# Altium project PID_preheaterV2.PrjPcb
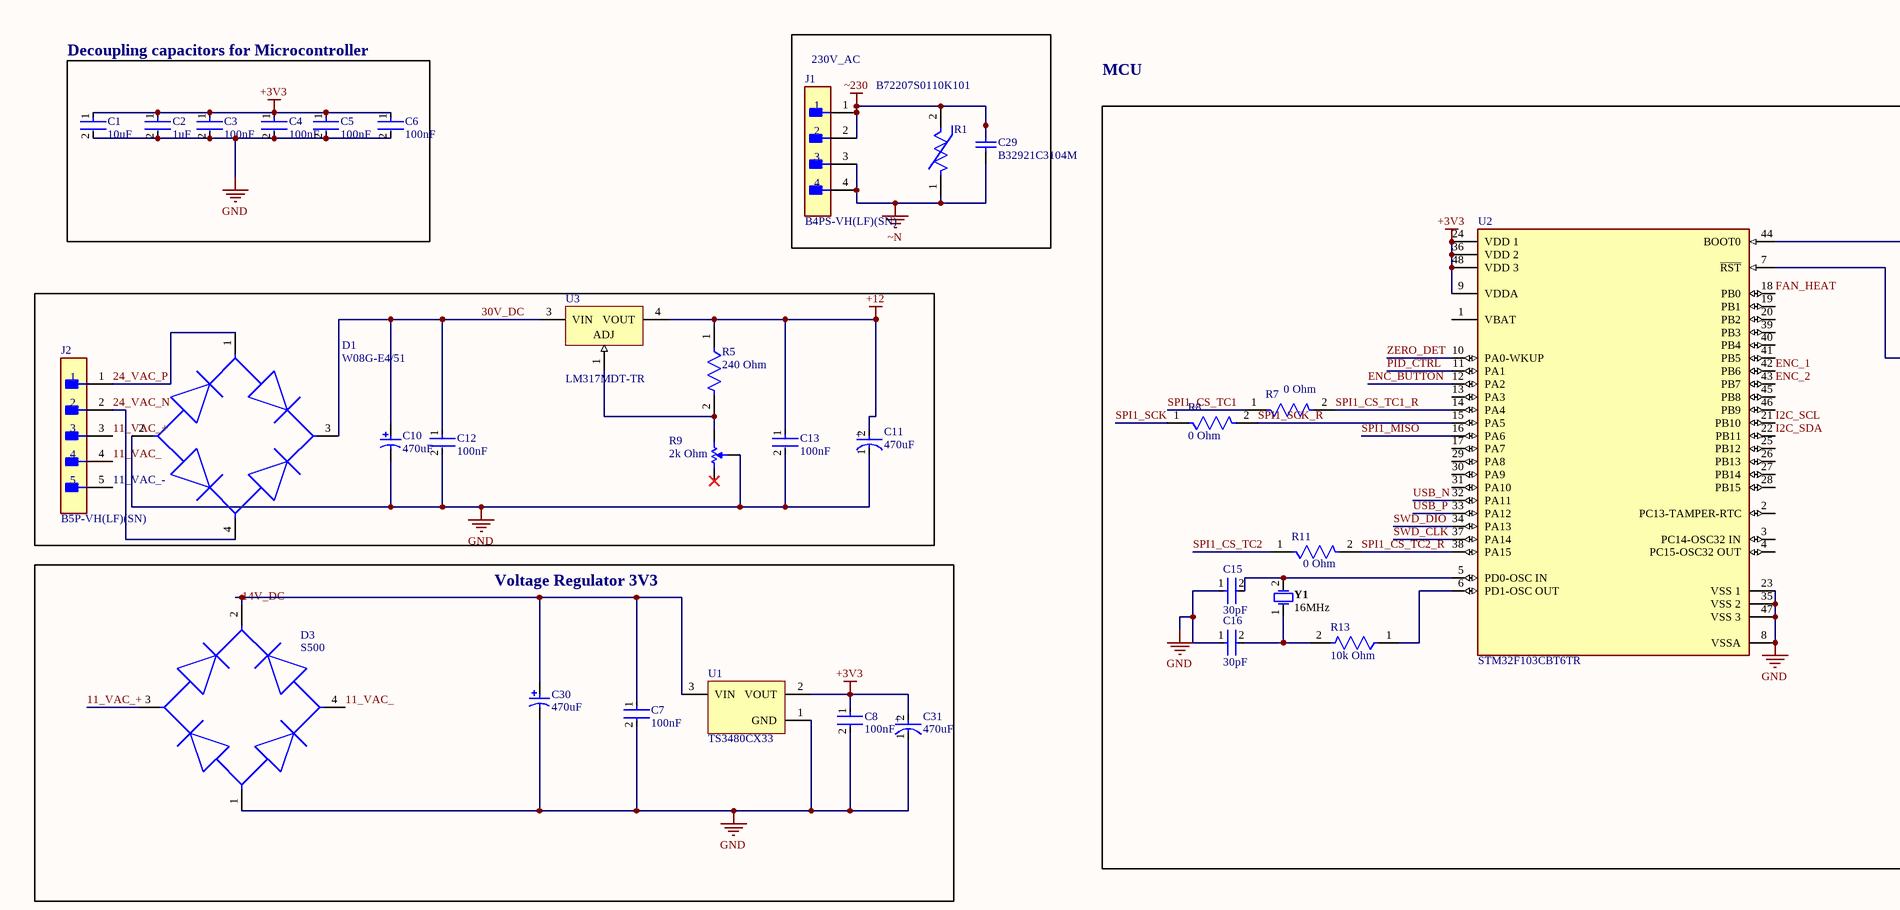
[diagram p0: SheetV2.SchDoc, top left]
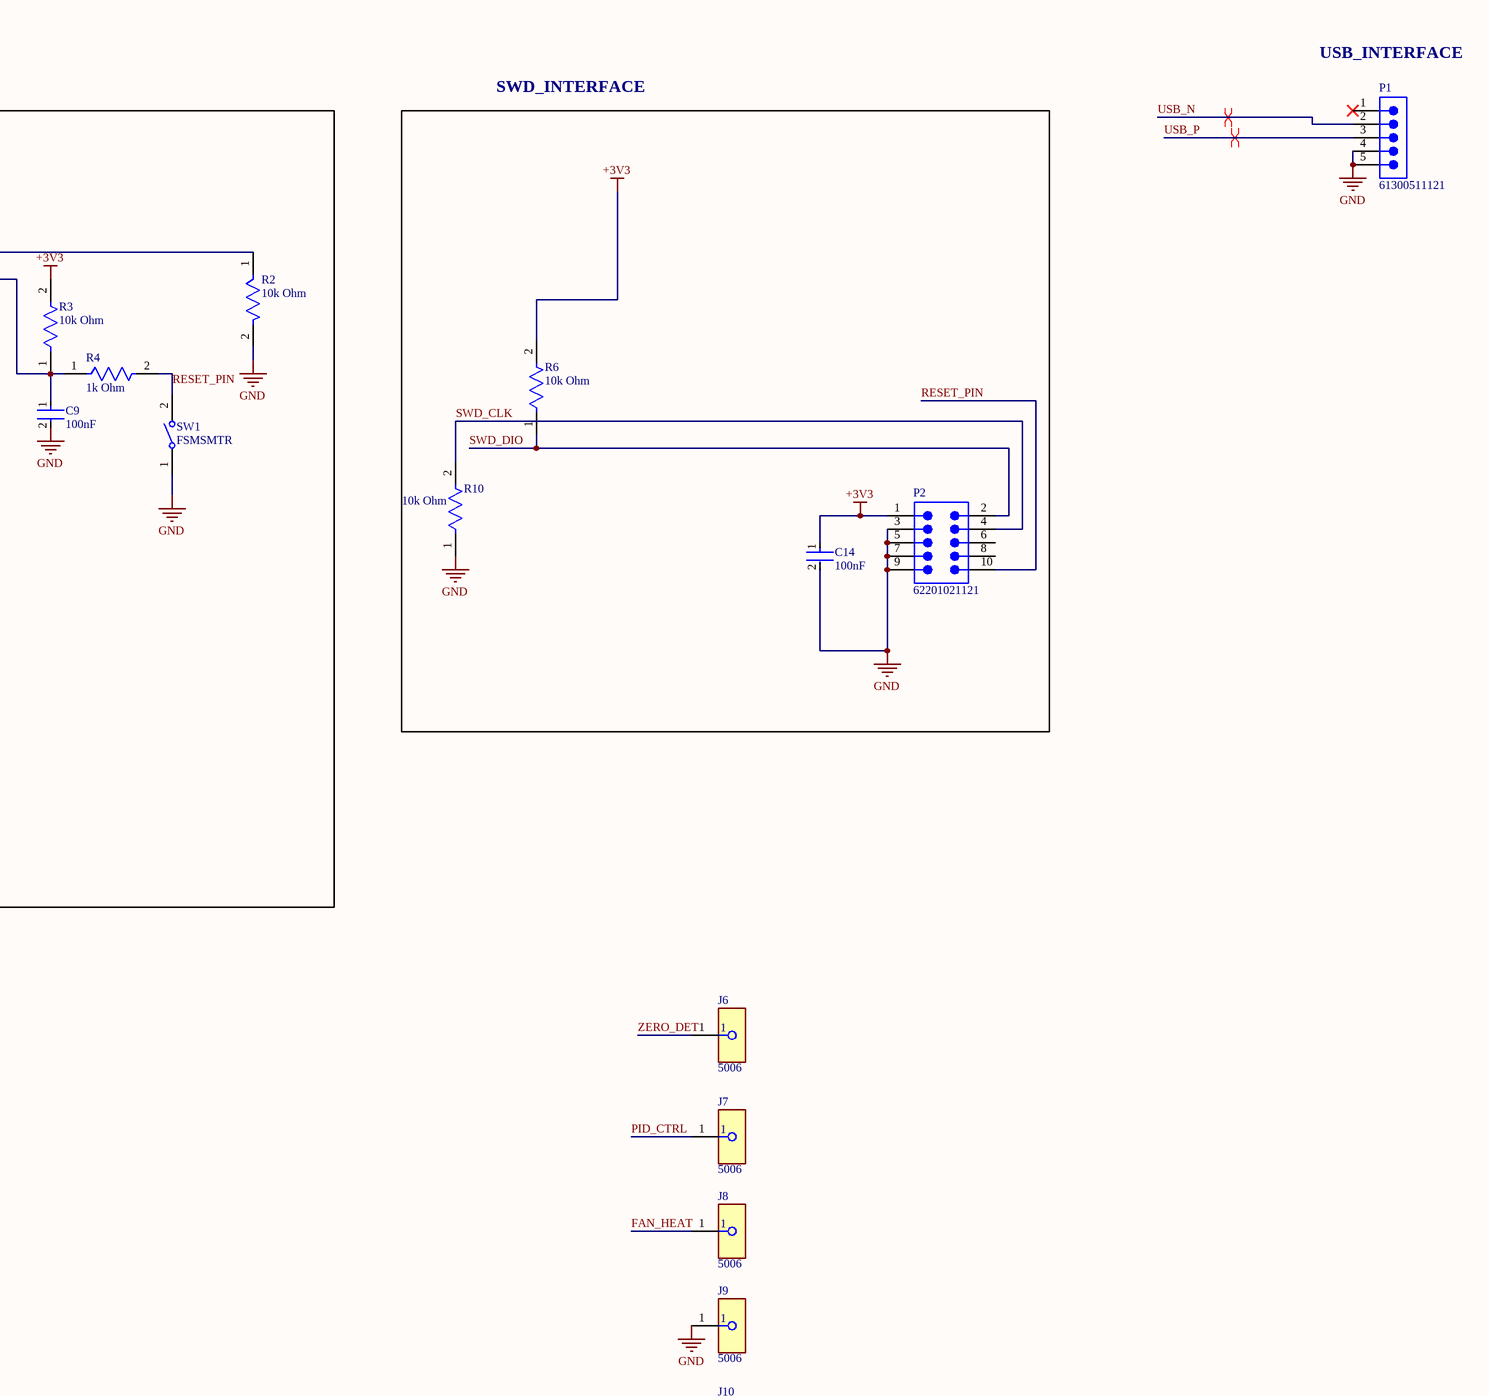
[diagram p1: SheetV2.SchDoc, top right]
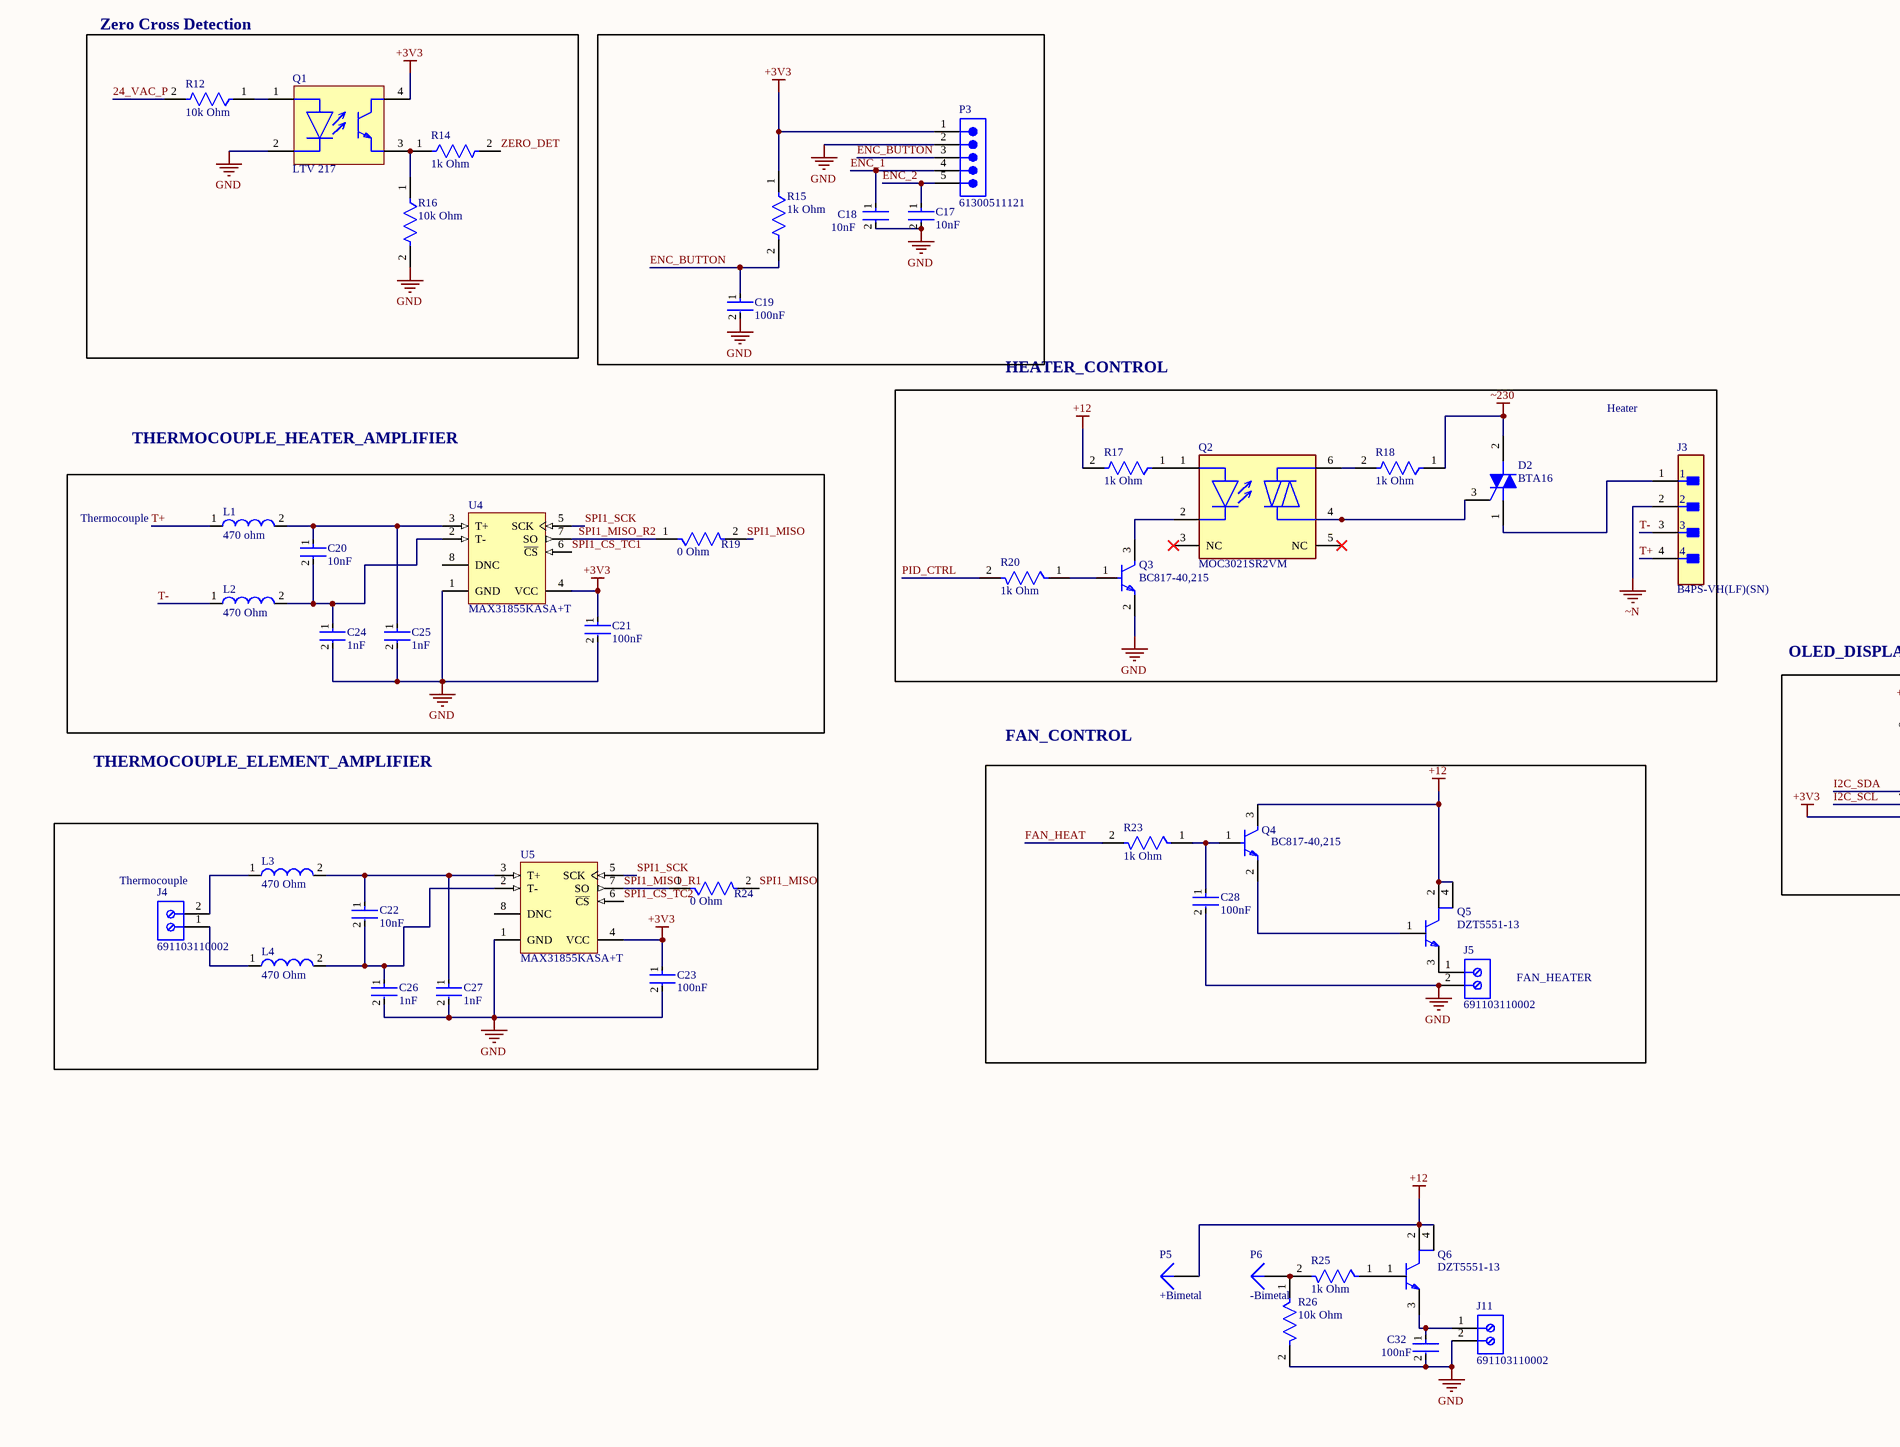
[diagram p2: SheetV2.SchDoc, bottom left]
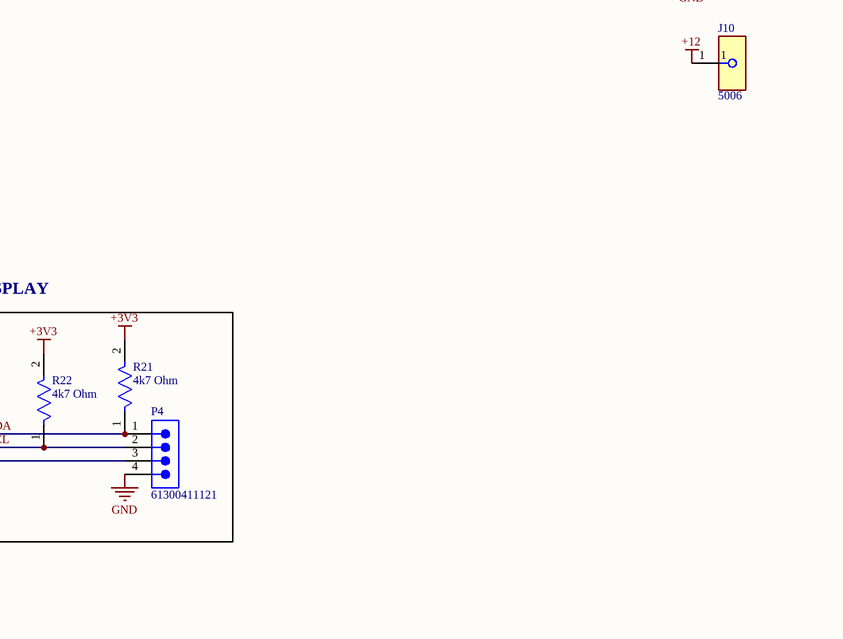
[diagram p3: SheetV2.SchDoc, bottom right]
1 sheet, 95 parts. Net scope: global (net labels, ports and power ports of the same name join across sheets).
Board file: PCBV21.PcbDoc

## Sheet SheetV2.SchDoc: PID Heater upgrade
size A1; Date: 06.07.2025; Author: Grzegorz Jabłoński; DrawnBy: Grzegorz Jabłoński; DocumentNumber: 1/1; Revision: V2.0; SheetNumber: 1; SheetTotal: 1

### Parts
C1  10uF  [FP-CC0805-0_85-MFG]
C2  1uF  [FP-CC0805-0_85-MFG]
C3  100nF  [FP-CC0805-0_85-MFG]
C4  100nF  [FP-CC0805-0_85-MFG]
C5  100nF  [FP-CC0805-0_85-MFG]
C6  100nF  [FP-CC0805-0_85-MFG]
C7  100nF  [FP-CC0805-0_85-MFG]
C8  100nF  [FP-CC0805-0_85-MFG]
C9  100nF  [FP-CC0805-0_85-MFG]
C10  470uF  [CAPPR65-500-2000X1000X2200]
C11  470uF  [FP-RAD-TH-D_8_0_5-L_11_5-MFG]
C12  100nF  [FP-CC0805-0_85-MFG]
C13  100nF  [FP-CC0805-0_85-MFG]
C14  100nF  [FP-CC0805-0_85-MFG]
C15  30pF  [FP-CC0805-0_85-MFG]
C16  30pF  [FP-CC0805-0_85-MFG]
C17  10nF  [FP-CC0805-0_85-MFG]
C18  10nF  [FP-CC0805-0_85-MFG]
C19  100nF  [FP-CC0805-0_85-MFG]
C20  10nF  [FP-CC0805-0_85-MFG]
C21  100nF  [FP-CC0805-0_85-MFG]
C22  10nF  [FP-CC0805-0_85-MFG]
C23  100nF  [FP-CC0805-0_85-MFG]
C24  1nF  [FP-CC0805-0_85-MFG]
C25  1nF  [FP-CC0805-0_85-MFG]
C26  1nF  [FP-CC0805-0_85-MFG]
C27  1nF  [FP-CC0805-0_85-MFG]
C28  100nF  [FP-CC0805-0_85-MFG]
C29  B32921C3104M  [TDK-B32921C3104M]
C30  470uF  [CAPPR65-500-2000X1000X2200]
C31  470uF  [FP-RAD-TH-D_8_0_5-L_11_5-MFG]
C32  100nF  [FP-CC0805-0_85-MFG]
D1  W08G-E4/51  [FP-WOG-MFG]
D2  BTA16  [ONSC-TO-220-3-221A-09]
D3  S500  [FP-MB2S-E3-80-MFG]
J1  B4PS-VH(LF)(SN)  [FP-B4PS-VH_LF_SN-MFG]
J2  B5P-VH(LF)(SN)  [FP-B5P-VH_LF_SN-MFG]
J3  B4PS-VH(LF)(SN)  [FP-B4PS-VH_LF_SN-MFG]
J4  691103110002  [691103110002]
J5  691103110002  [691103110002]
J6  5006  [FP-5006-MFG]
J7  5006  [FP-5006-MFG]
J8  5006  [FP-5006-MFG]
J9  5006  [FP-5006-MFG]
J10  5006  [FP-5006-MFG]
J11  691103110002  [691103110002]
L1  470 ohm  [SMD-0805]
L2  470 Ohm  [SMD-0805]
L3  470 Ohm  [SMD-0805]
L4  470 Ohm  [SMD-0805]
P1  61300511121  [61300511121]
P2  62201021121  [62201021121]
P3  61300511121  [61300511121]
P4  61300411121  [61300411121]
P5  +Bimetal  [PIN1]
P6  -Bimetal  [PIN1]
Q1  LTV 217  [SOP127P700X210_HS-5_SO4-Opto2_N]
Q2  MOC3021SR2VM  [FP-646BY-MFG]
Q3  BC817-40,215  [FP-SOT23-MFG]
Q4  BC817-40,215  [FP-SOT23-MFG]
Q5  DZT5551-13  [FP-SOT223-MFG]
Q6  DZT5551-13  [FP-SOT223-MFG]
R1  B72207S0110K101  [FP-B72207S0110K101-MFG]
R2  10k Ohm  [FP-RMCF0805-MFG]
R3  10k Ohm  [FP-RMCF0805-MFG]
R4  1k Ohm  [FP-RMCF0805-MFG]
R5  240 Ohm  [FP-RMCF0805-MFG]
R6  10k Ohm  [FP-RMCF0805-MFG]
R7  0 Ohm  [FP-RMCF0805-MFG]
R8  0 Ohm  [FP-RMCF0805-MFG]
R9  2k Ohm  [BOUR-3296W-1-3]
R10  10k Ohm  [FP-RMCF0805-MFG]
R11  0 Ohm  [FP-RMCF0805-MFG]
R12  10k Ohm  [FP-RMCF0805-MFG]
R13  10k Ohm  [FP-RMCF0805-MFG]
R14  1k Ohm  [FP-RMCF0805-MFG]
R15  1k Ohm  [FP-RMCF0805-MFG]
R16  10k Ohm  [FP-RMCF0805-MFG]
R17  1k Ohm  [FP-RMCF0805-MFG]
R18  1k Ohm  [FP-RMCF0805-MFG]
R19  0 Ohm  [FP-RMCF0805-MFG]
R20  1k Ohm  [FP-RMCF0805-MFG]
R21  4k7 Ohm  [FP-RMCF0805-MFG]
R22  4k7 Ohm  [FP-RMCF0805-MFG]
R23  1k Ohm  [FP-RMCF0805-MFG]
R24  0 Ohm  [FP-RMCF0805-MFG]
R25  1k Ohm  [FP-RMCF0805-MFG]
R26  10k Ohm  [FP-RMCF0805-MFG]
SW1  FSMSMTR  [TECO-FSMSMTR_V]
U1  TS3480CX33  [SOT-23-TT3_L]
U2  STM32F103CBT6TR  [FP-LQFP48-5B-MFG]
U3  LM317MDT-TR  [TO-252_L]
U4  MAX31855KASA+T  [MAXM-S8+4_N]
U5  MAX31855KASA+T  [MAXM-S8+4_N]
Y1  16MHz  [FOX-FOXSLF160-20]

### Blocks framed on the sheet
Decoupling capacitors for Microcontroller: C1-C6
230V_AC: C29 J1 R1
SWD_INTERFACE: C14 P2 R6 R10
11_VAC_-: C10-C13 D1 J2 R5 R9 U3
Voltage Regulator 3V3: C7 C8 C30 C31 D3 U1
Zero Cross Detection: Q1 R12 R14 R16
HEATER_CONTROL: D2 J3 Q2 Q3 R17 R18 R20
Thermocouple: C20 C21 C24 C25 L1 L2 R19 U4
OLED_DISPLAY: P4 R21 R22
FAN_HEATER: C28 J5 Q4 Q5 R23
Thermocouple: C22 C23 C26 C27 J4 L3 L4 R24 U5

### Nets
+3V3: C1.1 C2.1 C3.1 C4.1 C5.1 C6.1 C8.1 C14.1 C21.1 C23.1 C31.2(A) P2.1 P3.1 P4.3 Q1.4(C) R3.2 R6.2 R15.1 R21.2 R22.2 U1.2(VOUT) U2.9(VDDA) U2.24(VDD_1) U2.36(VDD_2) U2.48(VDD_3) U4.4(VCC) U5.4(VCC)
+12: C11.2(A) C13.1 J10.1 P5.1 Q4.3(C) Q5.2(C) Q5.4(C) Q6.2(C) Q6.4(C) R5.1 R17.2 U3.4(VOUT)
GND: C1.2 C2.2 C3.2 C4.2 C5.2 C6.2 C7.2 C8.2 C9.2 C10.2 C11.1(C) C12.2 C13.2 C14.2 C15.1 C16.1 C17.2 C18.2 C19.2 C21.2 C23.2 C24.2 C25.2 C26.2 C27.2 C28.2 C30.2 C31.1(C) C32.2 D1.2(+) D3.1(C) J5.2 J9.1 J11.2 P1.4 P1.5 P2.3 P2.5 P2.7 P2.9 P3.2 P4.4 Q1.2(C) Q3.2(E) R2.2 R9.3(TAP) R10.1 R16.2 R26.2 SW1.1 U1.1(GND) U2.8(VSSA) U2.23(VSS_1) U2.35(VSS_2) U2.47(VSS_3) U4.1(GND) U5.1(GND)
~230: C29.2 D2.2(MT2) J1.1 J1.2 R1.2 R18.1
~N: C29.1 J1.3 J1.4 J3.2 R1.1
11_VAC_: D3.4(2_~) J2.4
11_VAC_+: D3.3(1_~) J2.3
14V_DC: C7.1 C30.1 D3.2(A) U1.3(VIN)
24_VAC_N: D1.4(2_~) J2.2
24_VAC_P: D1.1(1_~) J2.1 R12.2
30V_DC: C10.1 C12.1 D1.3(-) U3.3(VIN)
ENC_1: C18.1 P3.4 U2.42(PB6)
ENC_2: C17.1 P3.5 U2.43(PB7)
ENC_BUTTON: C19.1 P3.3 R15.2 U2.12(PA2)
FAN_HEAT: J8.1 R23.2 U2.18(PB0)
I2C_SCL: P4.2 R22.1 U2.21(PB10)
I2C_SDA: P4.1 R21.1 U2.22(PB11)
PID_CTRL: J7.1 R20.2 U2.11(PA1)
RESET_PIN: P2.10 R4.2 SW1.2
SPI1_CS_TC1: R7.1 U4.6(~{CS})
SPI1_CS_TC1_R: R7.2 U2.14(PA4)
SPI1_CS_TC2: R11.1 U5.6(~{CS})
SPI1_CS_TC2_R: R11.2 U2.38(PA15)
SPI1_MISO: R19.2 R24.2 U2.16(PA6)
SPI1_MISO_R1: R24.1 U5.7(SO)
SPI1_MISO_R2: R19.1 U4.7(SO)
SPI1_SCK: R8.1 U4.5(SCK) U5.5(SCK)
SPI1_SCK_R: R8.2 U2.15(PA5)
SWD_CLK: P2.4 R10.2 U2.37(PA14)
SWD_DIO: P2.2 R6.1 U2.34(PA13)
T+: J3.4 L1.1
T-: J3.3 L2.1
USB_N: P1.2 U2.32(PA11)
USB_P: P1.3 U2.33(PA12)
ZERO_DET: J6.1 R14.2 U2.10(PA0-WKUP)
NetC9_1: C9.1 R3.1 R4.1 U2.7(~{RST})
NetC15_2: C15.2 U2.5(PD0-OSC_IN) Y1.2
NetC16_2: C16.2 R13.2 Y1.1
NetC20_1: C20.1 C25.1 L1.2 U4.3(T+)
NetC20_2: C20.2 C24.1 L2.2 U4.2(T-)
NetC22_1: C22.1 C27.1 L3.2 U5.3(T+)
NetC22_2: C22.2 C26.1 L4.2 U5.2(T-)
NetC28_1: C28.1 Q4.1(B) R23.1
NetC32_1: C32.1 J11.1 Q6.3(E)
NetD2_1: D2.1(MT1) J3.1
NetD2_3: D2.3(G) Q2.4(1_MAIN_TERM)
NetJ4_1: J4.1 L4.1
NetJ4_2: J4.2 L3.1
NetJ5_1: J5.1 Q5.3(E)
NetP6_1: P6.1 R25.2 R26.1
NetQ1_1: Q1.1(A) R12.1
NetQ1_3: Q1.3(E) R14.1 R16.1
NetQ2_1: Q2.1(A) R17.1
NetQ2_2: Q2.2(C) Q3.3(C)
NetQ2_6: Q2.6(2_MAIN_TERM) R18.2
NetQ3_1: Q3.1(B) R20.1
NetQ4_2: Q4.2(E) Q5.1(B)
NetQ6_1: Q6.1(B) R25.1
NetR2_1: R2.1 U2.44(BOOT0)
NetR5_2: R5.2 R9.2(B) U3.1(ADJ)
NetR13_1: R13.1 U2.6(PD1-OSC_OUT)

Not connected (* = marked no-connect by the designer): J2 5; P1 1*; P2 6 8; Q2 3(NC)* 5(NC)*; R9 1(A)*; U2 1(VBAT) 2(PC13-TAMPER-RTC) 3(PC14-OSC32_IN) 4(PC15-OSC32_OUT) 13(PA3) 17(PA7) 19(PB1) 20(PB2) 25(PB12) 26(PB13) 27(PB14) 28(PB15) 29(PA8) 30(PA9) 31(PA10) 39(PB3) 40(PB4) 41(PB5) 45(PB8) 46(PB9); U4 8(DNC); U5 8(DNC)

### Layout directives
differential pair: USB_N, USB_P

### Notes on the sheet
- MCU
- (near P1) USB_INTERFACE
- THERMOCOUPLE_HEATER_AMPLIFIER
- Heater
- THERMOCOUPLE_ELEMENT_AMPLIFIER
- FAN_CONTROL
- (in symbol CMP-05427-001287-1) +

### Library data of the parts
C1 C2 C15-C18 C20 C22 C24-C27 = CMP-2100-03606-3: CAP CER 0.1UF 50V X7R 0805; Manufacturer Part Number: CC0805KRX7R9BB104; Manufacturer: Yageo; Tolerance: 0.1; Capacitance: 100 nF; Value: 100 nF; Material: Ceramic; Device Class L1: Passive Components; ComponentLink2Description: Datasheet; Package: CC0805-0.85; Digikey Description: CAP CER 0.1UF 50V X7R 0805; Device Class L3: Ceramic Capacitors; Temperature: -30°C to +85°C; Temperature Characteristic: X7R; Voltage Rating: 50 V; Height: 0.95mm; RoHS: TRUE; Ipc Land Pattern Name: CAPC200125X85; Device Class L2: Capacitors; Category: Cap; Temperature Range Low: -30°C; Temperature Range High: +85°C; Mouser Description: Multilayer Ceramic Capacitors MLCC - SMD/SMT 100nF 50V X7R 10%; Footprint Url: http://www.yageo.com/exep/pages/download/literatures/UPY-C_GEN_24.pdf; Automotive: No; Octopart: https://octopart.com/cc0805krx7r9bb104-yageo-192993; Lead Free: Yes; ComponentLink2URL: http://www.yageo.com/documents/recent/UPY-GPHC_Y5V_6.3V-to-50V_8.pdf
C3-C9 C12-C14 C19 C21 C23 C28 C32 = CMP-2100-03606-3: CAP CER 0.1UF 50V X7R 0805; Manufacturer Part Number: CC0805KRX7R9BB104; Manufacturer: Yageo; Tolerance: 0.1; Material: Ceramic; Device Class L1: Passive Components; ComponentLink2Description: Datasheet; Package: CC0805-0.85; Digikey Description: CAP CER 0.1UF 50V X7R 0805; Capacitance: 100 nF; Device Class L3: Ceramic Capacitors; Value: 100 nF; Temperature: -30°C to +85°C; Temperature Characteristic: X7R; Voltage Rating: 50 V; Height: 0.95mm; RoHS: TRUE; Ipc Land Pattern Name: CAPC200125X85; Device Class L2: Capacitors; Category: Cap; Temperature Range Low: -30°C; Temperature Range High: +85°C; Mouser Description: Multilayer Ceramic Capacitors MLCC - SMD/SMT 100nF 50V X7R 10%; Footprint Url: http://www.yageo.com/exep/pages/download/literatures/UPY-C_GEN_24.pdf; Automotive: No; Octopart: https://octopart.com/cc0805krx7r9bb104-yageo-192993; Lead Free: Yes; ComponentLink2URL: http://www.yageo.com/documents/recent/UPY-GPHC_Y5V_6.3V-to-50V_8.pdf
C10 C30 = CMP-1665-00046-1: Aluminum Electrolytic Capacitor, 470 uF, +/- 20%, 50 V, -40 to 85 degC, 2-Pin THD, RoHS, Bulk; Voltage Rating: 10 V; Case\Package: 1210; Tolerance: 10%; Capacitance: 47 uF; Type (Capacitors): X7R; ComponentLink1URL: http://www.panasonic.com/; PackageDescription: 2-Pin Radial Lead, Dia 10 mm, Body Length 20 mm; RoHSCompliant: true; Mount: Surface Mount; Radiation Hardening: No; PackageReference: CAPPR65-500-2000X1000X2200; ComponentLink1Description: Manufacturer URL; DatasheetVersion: Mar-16; Case Code (Imperial): 1210; Max Operating Temperature: 125 degC; Height: 2.5 mm; Voltage Rating (DC): 10 V; REACH SVHC: No SVHC; ComponentLink2URL: http://industrial.panasonic.com/cdbs/www-data/pdf/RDF0000/ABA0000C1047.pdf; Length: 3.2 mm; Min Operating Temperature: -55 degC; Case Code (Metric): 3225; Width: 2.5 mm; Pins: 2; Packaging: Tape and Reel; Package Quantity: 1000; ComponentLink2Description: Datasheet
C11 C31 = CMP-05427-001287-1: Aluminum Electrolytic Capacitors (Radial Lead Type) 470uF ±20% 16V; Life (Hours): 6000Hour; Lead Diameter: 0.6mm; Ripple Current: 950mA; Impedance: 56mR; Voltage Rating: 16V; Features: General Purpose; Capacitance: 470uF; Max Operating Temperature: 105°C; RoHS Compliant: Yes; Mount: Through Hole; Termination: Radial; Voltage Rating (DC): 16V; Series: FR; Case/Package: Radial; Radiation Hardening: No; Diameter: 8mm; Lead Free: Lead Free; Height - Seated (Max): 0.512inch; Lead Pitch: 5mm; Tolerance: 20%; Height: 11.5mm; ESR (Equivalent Series Resistance): 56mR; Packaging: Ammo Pack; Length: 11.5mm; Package Quantity: 1; Min Operating Temperature: -40°C; REACH SVHC: No SVHC
C29 = CMP-2000-05890-1: EMI Suppression Capacitor (MKP), 0.1 uF, +/- 20%, 305 V, 2-Pin THD, RoHS, Bulk; Manufacturer: TDK; PCN Packaging: MKT,MKPTypeLaserMarking26/Apr/2013; Online Catalog: B32921C/D-B32928C/DSeries; Featured Product: FilmCapacitors; Product Training Modules: FilmCapacitorsCapacitorsforLEDApplicationsAutomotiveIndustryCapacitors; Catalog Drawings: Y(1,2),X(1,2)SeriesSide1Y(1,2),X(1,2)SeriesSide2; PCN Design/Specification: B32(5679)B333Series02/May/2014; Other Names: 495-2318B32921C3104M000B32921C3104MN1; Capacitance: 0.1µF; Voltage Rating - AC: 305V; Dielectric Material: Polypropylene(PP); Datasheet URL: https://en.tdk.eu/inf/20/20/db/fc_2009/X2_B32921_928.pdf; Package / Case: Radial; Operating Temperature: -40°C~110°C; Lead Spacing: 0.394"(10.00mm); Size / Dimension: 0.512"Lx0.236"W(13.00mmx6.00mm); Package Reference: B32921C3104M; Datasheet Version: 09/2016; Features: X2SafetyRated; Standard Package: 1,000; Category: Capacitors; Package Description: 2-Pin Through Hole Device, Body 13 x 6 mm, Pitch 10 mm; Family: FilmCapacitors; ESR (Equivalent Series Resistance): -; Voltage Rating - DC: -; Termination: PCPins; Packaging: Bulk; Mounting Type: ThroughHole; Height - Seated (Max): 0.472"(12.00mm); Mounting Technology: ThroughHole; Manufacturer URL: http://www.tdk.com/; Applications: EMI,RFISuppression; Tolerance: ±20%; Series: B32921
D1 = CMP-00030-42174390-1: W08G-E4/51 Diode Rectifier Bridge Single 800V 1.5A 4-Pin Case WOG Bulk; Peak Reverse Current: 5µA; Number of Elements: 1; Forward Voltage: 1V; Max Surge Current: 50A; Capacitance: 14pF; Lead Free: Lead Free; Element Configuration: Single; Number of Pins: 4; Breakdown Voltage: 800V; Average Rectified Current: 1.5A; Width: 8.84mm; Max Repetitive Reverse Voltage (Vrrm): 800V; RoHS: Compliant; Length: 9.86mm; REACH SVHC: Unknown; NexarPartId: 42174390; Forward Current: 1.5A; Radiation Hardening: No; Height: 5.6mm; Diameter: 9mm; Min Operating Temperature: -55°C; Peak Non-Repetitive Surge Current: 50A; Schedule B: 8541100080, 8541100080; Max Reverse Leakage Current: 5µA; Max Operating Temperature: 150°C; Mount: Through Hole; Output Current: 1.5A
D2 = CMP-1070-00099-1: Sensitive Gate Triacs, Silicon Bidirectional Thyristor, 3-Pin TO-220, Pb-Free, Bulk Box; PartNumber: MAC228A6G; Manufacturer: On Semiconductor; ITSM Max (A): 80; IT(RMS) Max (A): 8; DatasheetVersion: Rev. 7; ComponentLink2Description: Datasheet; PackageDescription: 3-Pin Flange Mount, Vertical Straight Lead, Body 9.97 x 4.445 mm, Pitch 2.54 mm; Packing: Bulk Box; ComponentLink3Description: Package Specification; RoHS: Pb-Free; ComponentLink2URL: http://www.onsemi.com/pub_link/Collateral/MAC228A-D.PDF; ComponentLink3URL: http://www.onsemi.com/pub_link/Collateral/221A-09.PDF; ComponentLink1URL: http://www.onsemi.com/; PackageVersion: Rev. AG, 09/2011; PackageReference: TO-220-3-221A-09; ComponentLink1Description: Manufacturer URL; Mounting Technology: Through Hole
D3 = CMP-02540-000057-1: BRIDGE RECT 1P 200V TO269AA; Peak Non-Repetitive Surge Current: 35A; Number of Elements: 1; Forward Voltage: 1V; Forward Current: 500mA; Max Reverse Leakage Current: 5uA; Element Configuration: Single; Min Operating Temperature: -55°C; Mount: Surface Mount; Flammability Rating: UL94 V-0; Max Operating Temperature: 150°C; Lead Free: Lead Free; Contact Plating: Tin; Max Repetitive Reverse Voltage (Vrrm): 200V; Height: 2.7mm; Package Quantity: 1; Packaging: Tape and Reel; Average Rectified Current: 500mA; Radiation Hardening: No; Max Surge Current: 35A; Max Reverse Current: 5uA; Number of Pins: 4; Max Forward Surge Current (Ifsm): 35A; Width: 4.1mm; Length: 4.95mm
J1 J3 = CMP-17439-000047-1: CONN HEADER R/A 4POS 3.96MM; Max Current Rating: 10A; Contact Resistance: 20mR; Number of Positions: 4; Max Voltage Rating (AC): 250V; Gender: Male; Insulation Resistance: 1GR; Contact Material: Brass; Insulation Material: Nylon; Housing Material: Polyamide; Termination: Solder; Depth: 14.9mm; Contact Type: Male Pin; Working Voltage: 250V; Voltage Rating (AC): 250V; Voltage Rating (DC): 250V; Contact Finish - Mating: TIN; Packaging: Bulk; Series: VH; Connector Type: Header; Current Rating: 10A; Contact Mating Length: 0.303inch; Flammability Rating: UL94 V-0; Pitch: 3.96mm; Min Operating Temperature: -25°C; Insulation Color: Natural; Mount: Through Hole; Max Operating Temperature: 85°C; Housing Color: White; REACH SVHC: No SVHC; Contact Shape: Square; Fastening Type: Ramp; Color: Natural; Contact Plating: Copper; Lead Free: Lead Free; Number of Rows: 1; Lead Pitch: 3.96mm; Length: 15.78mm; Number of Contacts: 4; Orientation: Right Angle; Voltage Rating: 250V
J2 = CMP-17439-000253-1: CONN HEADER VERT 5POS 3.96MM; Voltage Rating: 250V; Current Rating: 10A; Gender: Male; Contact Resistance: 20mR; Number of Positions: 5; Mated Stacking Heights: 16.5mm; Mount: Through Hole; Housing Color: White; REACH SVHC: No SVHC; Contact Mating Length: 0.303inch; Insulation Material: Nylon; Contact Type: Male Pin; Min Operating Temperature: -25°C; Lead Free: Lead Free; Contact Shape: Square; Color: Natural; Packaging: Bulk; Flammability Rating: UL94 V-0; Number of Rows: 1; Max Operating Temperature: 85°C; Pitch: 3.96mm; Fastening Type: Ramp; Number of Pins: 5; Termination: Solder; Width: 14.6mm; Orientation: Straight; Max Current Rating: 10A; Housing Material: Polyamide; Height: 8.5mm; Length: 19.74mm; Contact Plating: Copper; Contact Finish - Mating: TIN; Depth: 8.5mm; Connector Type: Header; Max Voltage Rating (AC): 250V; Contact Material: Brass; Insulation Color: Natural; Number of Contacts: 5; Series: VH
J4 J5 J11 = CMP-1502-03254-2: NexarPartId: 18818286; Pitch: 3.5052mm; Current Rating: 10A; Number of Positions Per Level: 2; Plating: Steel; Number of Levels: 1; Voltage: 125V; Wire/Cable Gauge: 26AWG; Stripping Length: -6mm; Wire Gauge (Min): 16AWG; Packaging: Box; Number of Rows: 1; Color: Blue; Height: 8.5mm; Current: 10A; Lead Pitch: 3.5mm; RoHS: Compliant; Housing Material: Nylon; Width: 8mm; Length: 7mm; Contact Plating: Tin; Number of Pins: 2; Mount: Through Hole; Min Operating Temperature: -40°C; Number of Contacts: 2; REACH SVHC: Unknown; Termination: Screw; Wire Gauge (Max): 26AWG; Max Operating Temperature: 105°C; Voltage Rating: 125V; Contact Material: Brass, Copper, Nickel, Tin, Zinc
J6-J10 = CMP-19636-000022-1: PC TEST POINT COMPACT BLACK; Body Material: Bronze; Inside Diameter: 1.78mm; Number of Ports: 1; Hole Diameter: 1.6mm; Outside Diameter: 3.18mm; Plating: Silver; Contact Plating: Tin; Color: Black; RoHS Compliant: Yes; Flammability Rating: UL94 V-0; Contact Material: Bronze; Material: Nylon; Orientation: Straight; Package Quantity: 100; Housing Color: Black; Length: 8.89mm; Series: THM; Mount: PCB; Height: 0.35inch; Packaging: Bulk; REACH SVHC: No SVHC; Insulation Material: Nylon; Lead Free: Lead Free
L1-L4 = CMP-0220-00035-1: SMD EMI Suppression Ferrite Bead WE-CBF, Z = 470 Ohm; PackageReference: SMD-0805; PackageVersion: 2005; ComponentLink2URL: http://www.we-online.de/katalog/media/pdf/742792036.pdf; ComponentLink1Description: Manufacturer Link; ComponentLink2Description: Datasheet; Impedance: 470 Ohm; DatasheetVersion: Dec-2005; ComponentLink1URL: http://www.we-online.com; PackageDescription: Chip Inductor, 2-Leads, Body 2.0 x 1.2 mm
P1 P3 = CMP-1502-01068-3: NexarPartId: 32855526; Connector Type: Male Pin; Gender: Male; Contact Resistance: 20mΩ; Pitch: 2.54mm; Operating Supply Voltage: 250V; Current Rating: 3A; Number of Contacts: 5; Lead Free: Lead Free; Color: Black; Packaging: Bulk; Lead Pitch: 2.54mm; Contact Material: Copper; Min Operating Temperature: -40°C; Contact Mating Length: 5.9944mm; Voltage Rating: 250V; Number of Pins: 5; Number of Positions: 5; Height: 8.89mm; Orientation: Vertical; REACH SVHC: Unknown; RoHS: Compliant; Contact Plating: Gold; Max Operating Temperature: 105°C; Mount: Through Hole; Number of Rows: 1; Termination: Solder
P2 = CMP-1502-00948-3: NexarPartId: 32855586; Pitch: 1.27mm; Operating Supply Voltage: 100V; Connector Type: Male Pin; Contact Resistance: 20mΩ; Current Rating: 1A; Number of Contacts: 10; Gender: Male; Contact Mating Length: 3.81mm; Max Operating Temperature: 105°C; Mount: Through Hole; Number of Pins: 10; Row Spacing: 1.27mm; Lead Pitch: 1.27mm; REACH SVHC: Unknown; Min Operating Temperature: -40°C; Contact Material: Copper; Orientation: Vertical; Contact Plating: Gold; Number of Rows: 2; RoHS: Compliant; Packaging: Box; Voltage Rating: 100V; Color: Black; Height: 5.65mm; Termination: Solder; Number of Positions: 10
P4 = CMP-1502-01064-3: NexarPartId: 32855522; Operating Supply Voltage: 250V; Pitch: 2.54mm; Contact Resistance: 20mΩ; Number of Positions: 4; Current Rating: 3A; Connector Type: Male Pin; Gender: Male; Contact Plating: Gold; Height: 8.89mm; Lead Pitch: 2.54mm; Lead Free: Lead Free; Contact Mating Length: 5.9944mm; Number of Rows: 1; Termination: Solder; Packaging: Bulk; REACH SVHC: Unknown; Min Operating Temperature: -40°C; RoHS: Compliant; Number of Contacts: 4; Voltage Rating: 250V; Color: Black; Max Operating Temperature: 105°C; Contact Material: Copper; Mount: Through Hole; Orientation: Vertical; Number of Pins: 4
P5 P6 = Plug: LatestRevisionDate: 17-Jul-2002; LatestRevisionNote: Re-released for DXP Platform.; Publisher: Altium Limited
Q1 = CMP-00572-23028373-2: Optocoupler DC-IN 1-CH Transistor DC-OUT 4-Pin SSOP Embossed T/R; Manufacturer Lifecycle Status: ACTIVE; Max Input Current: 1A; Collector Emitter Saturation Voltage: 300mV; Current Transfer Ratio: 400%; Number of Circuits: 1; Forward Voltage: 1.4V; Max Power Dissipation: 120mW; Rise Time: 4µs; Max Collector Current: 40mA; Output Voltage: 40V; Forward Current: 50mA; Input Current: 5mA; Isolation Voltage: 2.5kV; Reverse Breakdown Voltage: 6V; ComponentLink1Description: Manufacturer's Website; Packaging: Cut Tape; RoHS: Compliant; Case/Package: SSOP; HelpURL: https://octopart.com/cad-content/api/get-model-datasheet/15189/23028373; Lead Free: Lead Free; Min Operating Temperature: -55°C; Height: 2.1mm; Number of Elements: 1; China RoHS: Compliant; Mount: Surface Mount; Number of Channels: 1; Lifecycle Status: Production; ComponentLink2URL: https://octopart.com/cad-content/api/get-model-datasheet/15189/23028373; Number of Pins: 4; Radiation Hardening: No; Collector Emitter Voltage (VCEO): 40V; ComponentLink2Description: Datasheet URL; ComponentLink1URL: http://www.renesas.com; REACH SVHC: No SVHC; Max Operating Temperature: 100°C
Q2 = CMP-00278-84330366-1: MOC3021SR2VM Triac Driver Output Optocoupler, 6-Pin DIP 400V Random Phase; Manufacturer Lifecycle Status: ACTIVE; Isolation Voltage: 7.5kV; Power Dissipation: 330mW; Hold Current: 100µA; Number of Circuits: 1; Approvals: EN, IEC, UL; Input Current: 60mA; Nominal Input Voltage: 1.15V; Reverse Breakdown Voltage: 3V; Max Input Voltage: 1.5V; Max Operating Temperature: 85°C; Weight: 810mg; Mount: Surface Mount; REACH SVHC: No SVHC; Case/Package: SMD/SMT; NexarPartId: 84330366; RoHS: Compliant; Lead Free: Lead Free; Schedule B: 8541408000, 8541408000; Number of Elements: 1; Number of Channels: 1; Packaging: Digi-Reel®; Forward Voltage: 1.15V; Forward Current: 60mA; Number of Pins: 6; Radiation Hardening: No; Output Voltage: 400V; Max Power Dissipation: 330mW; Lifecycle Status: Production; Min Operating Temperature: -40°C
Q3 Q4 = CMP-14406-000007-1: TRANS NPN 45V 0.5A SOT23; Manufacturer: Nexperia; Collector Emitter Saturation Voltage: 700mV; Power Dissipation: 250mW; Collector Base Voltage: 50V; Unity Gain Freq: 100MHz; Hfe Max: 600; Rthja Max: 500K/W; Emitter Base Voltage: 5V; Max Collector Current: 500mA; Hfe Testvce: 1V; Automotive Grade: Grade 0; Hfe Min: 250; Max Junction Temp: +150°C; Number Of Npn: 1; Hfe Testic: 100mA; Octopart: https://octopart.com/bc817-40%2C215-nexperia-78739081; Lead Free: Yes; Ipc Land Pattern Name: SOT95P230X100-3; Manufacturer Part Number: BC817-40,215; RoHS: TRUE; Collector Emitter Breakdown Voltage: 45V; Digikey Description: TRANS NPN 45V 0.5A SOT23; ComponentLink2URL: https://assets.nexperia.com/documents/data-sheet/BC817_SER.pdf; Temperature Range High: +150°C; Mouser Description: BC817 Series 45 V 500 mA 250 mW SMT NPN General-Purpose Transistor - SOT-23-; Device Class L3: BJTs; Temperature: to +150°C; Height: 1.1mm; Automotive: Yes; Ambient Temperature Range Low: -65°C; Package: SOT23; Collector Emitter Voltage: 45V; Category: Trans; ComponentLink2Description: Datasheet; Device Class L2: Transistors; Ambient Temperature Range High: +150°C; Number Of Elements: 1; Device Class L1: Discrete Semiconductors; Footprint Url: https://assets.nexperia.com/documents/outline-drawing/SOT23.pdf
Q5 Q6 = CMP-12798-000002-1: TRANS NPN 160V 0.6A SOT-223; Manufacturer: Diodes; Hfe Ss Min: 50; Rthja Max: 62.5°C/W; Emitter Base Voltage: 6V; Automotive Grade: Grade 0; Hfe Testic: 10mA; Hfe Ss Testic: 10A; Max Junction Temp: +150°C; Hfe Max: 250; Fall Time Tf: 140ns; Collector Base Voltage: 180V; Unity Gain Freq: 130MHz; Number Of Npn: 1; Standoff Height: 0.01mm; Delay Time Td: 95ns; Collector Emitter Breakdown Voltage: 200V; Hfe Ss Max: 260; Max Collector Current: 600mA; Hfe Testvce: 5V; Hfe Ss Testvce: 10V; Collector Emitter Saturation Voltage: 115mV; Hfe Min: 80; Rise Time Tr: 64ns; Power Dissipation: 2W; Footprint Url: https://www.diodes.com/assets/Package-Files/SOT223.pdf; ComponentLink2URL: https://www.diodes.com/assets/Datasheets/ds31219.pdf; Device Class L2: Transistors; Lead Free: Yes; Storage Time Ts: 1256ns; Temperature Range Low: -55°C; Mouser Description: Bipolar Transistors - BJT 1000mW 160Vceo; RoHS: TRUE; Collector Emitter Voltage: 160V; ComponentLink2Description: Datasheet; Device Class L3: BJTs; Automotive: Yes; Temperature: -55°C to +150°C; Package: SOT223; Device Class L1: Discrete Semiconductors; Temperature Range High: +150°C; Category: Trans; Digikey Description: TRANS NPN 160V 0.6A SOT-223; Height: 1.8mm; Octopart: https://octopart.com/dzt5551-13-diodes+inc.-12426785; Number Of Elements: 1; Manufacturer Part Number: DZT5551-13
R1 = CMP-10618-000012-1: VARISTOR 18V 250A DISC 7MM; Manufacturer: EPCOS; Voltage Rating Ac: 11V; Voltage Rating Dc: 14V; Clamping Voltage: 36V; Capacitance: 2750pF; Clamping Current: 2.5A; Value: 2750pF; Voltage Tolerance: 10%; ComponentLink2URL: https://product.tdk.com/info/en/documents/data_sheet/70/db/var/SIOV_Leaded_StandarD.pdf; Device Class L2: Varistors; Temperature: -40°C to +105°C; ComponentLink2Description: Datasheet; Device Class L3: unset; Lead Free: Yes; Package: B72207S0110K101; Automotive: No; Height: 11mm; Temperature Range Low: -40°C; RoHS: TRUE; Device Class L1: Circuit Protection; Varistor Voltage: 18V; Manufacturer Part Number: B72207S0110K101; Temperature Range High: +105°C; Octopart: https://octopart.com/b72207s0110k101-epcos-11931358; Category: Res; Mouser Description: Varistor: metal-oxide; THT; 11VAC; 14VDC; 18V; 250A; 800mJ; Digikey Description: VARISTOR 18V 250A DISC 7MM
R2-R8 R10-R26 = CMP-26527-000017-1: RES 0 OHM JUMPER 1/8W 0805; Power Rating: 125mW; Resistance: 0mR; Depth: 1.25mm; Length: 2mm; Military Standard: Not; Width: 0.049inch; Case Code (Imperial): 0805; Number of Terminations: 2; Mount: Surface Mount; Contact Plating: Tin; Height: 0.026inch; Case/Package: 0805; Min Operating Temperature: -55°C; Composition: Thick Film; Max Operating Temperature: 155°C; Packaging: Tape and Reel; Features: Automotive AEC-Q200; Max Power Dissipation: 125mW; Radiation Hardening: No; Lead Free: Lead Free; Case Code (Metric): 2012
R9 = CMP-1747-00002-1: Square Trimpot(R) Trimming Potentiometer, 1000 Ohm, -55 to 125 degC, 3-Pin THD, RoHS, Tube; Case\Package: 0603; Tolerance: 1%; Power Rating: 100 mW; Voltage Rating: 75 V; Resistance: 4.7 kohm; ComponentLink2URL: http://www.bourns.com/docs/Product-Datasheets/3296.pdf; Packaging: Tape and Reel; REACH SVHC: Yes; ComponentLink1URL: http://www.bourns.com/; Case Code (Metric): 1608; Width: 0.8 mm; ComponentLink1Description: Manufacturer URL; DatasheetVersion: May-16; Max Operating Temperature: 155 degC; PackageReference: 3296W-1-3; PackageDescription: 3-Pin Through Hole Device, Body 9.53 x 4.83 mm, Pitch 2.54 mm; Weight: 7.1E-05 oz; ComponentLink2Description: Datasheet; RoHSCompliant: true; Min Operating Temperature: -55 degC; Radiation Hardening: No; Case Code (Imperial): 0603; Length: 1.6 mm; Package Quantity: 5000; Pins: 2; Mount: Surface Mount; Height: 0.45 mm
SW1 = CMP-2000-07501-1: FSMSM Push Button Switch, 50 mA, -35 to 85 degC, 2-Pin SMD, RoHS, Tape and Reel; Manufacturer: TE Connectivity; Voltage Rating (DC): 24V; Electrical Life: 20000Cycles; Operating Force: 180gf; Switch Travel: 0.25mm; Contact Current Rating: 50mA; Case\/Package: SMD/SMT; Actuator Length: 1.07mm; Throw Configuration: SPST; Actuator Material: Polyamide; Contact Resistance: 100mOhm; Illumination Type: Illuminated; Max Voltage Rating (DC): 12V; Manufacturer URL: http://www.te.com/; Lead Free: LeadFree; Packaging: TapeandReel; Min Operating Temperature: -35degC; Mechanical Life: 20000Cycles; Mount: SurfaceMount; REACH SVHC: Unknown; Package Quantity: 1800; Package Reference: FSMSMTR; RoHSCompliant: true; Max Operating Temperature: 85degC; Orientation: Straight; ELV: Compliant; Datasheet URL: http://www.te.com/commerce/DocumentDelivery/DDEController?Action=showdoc&DocId=Customer+Drawing%7F1437566-3%7FC2%7Fpdf%7FEnglish%7FENG_CD_1437566-3_C2_1437566_3_1_c.dwg.pdf%7F1437566-4; Package Description: 2-Pin Surface Mount Device, Body 6 x 3.5 mm, Pitch 9.19 mm; Current Rating: 50mA; Contact Plating: Silver; Termination: GullWing; Datasheet Version: Rev. C2, 08/2014; Contact Material: Brass; Mounting Technology: SurfaceMount
U1 = CMP-0136-00788-1: Low Quiescent Current LDO, 3-Pin SOT-23, Extended Temperature, Tape and Reel; Code_IPC: SOT23-3; DatasheetVersion: revB, Feb-2007; PackageDescription: 3-Lead Plastic Small Outline Transistor (TT) [SOT-23]; PackageVersion: revBB, Aug-2009; PackageReference: SOT-23-TT3
U2 = CMP-0237-00247-4: NexarPartId: 12442975; Number of Channels: 10; Oscillator Type: Internal; Max Power Dissipation: 363mW; Number of PWM Channels: 4; Number of UART Channels: 3; RAM Size: 20kB; Frequency: 72MHz; Number of A/D Converters: 2; Memory Type: FLASH; Watchdog Timer: Yes; Data Bus Width: 32b; Number of Programmable I/O: 37; Peripherals: DMA, I2C, POR, PWM, Temp Sensor, WDT; Interface: CAN, I2C, IrDA, LIN, SPI, USART, USB; Number of USB Channels: 1; Flash Memory Size: 128kB; Core Architecture: ARM; Max Junction Temperature (Tj): 105°C; Min Supply Voltage: 2V; Nominal Supply Current: 1.7µA; Max Supply Voltage: 3.6V; Case/Package: LQFP; Length: 7mm; Min Operating Temperature: -40°C; Schedule B: 8542310000; Number of USART Channels: 3; Lead Free: Lead Free; Lifecycle Status: Production; RoHS: Compliant; Packaging: Tape & Reel (TR); Ambient Temperature Range High: 105°C; Max Operating Temperature: 85°C; Max Frequency: 72MHz; Number of SPI Channels: 2; Memory Size: 128kB; Number of Timers/Counters: 4; Radiation Hardening: No; Number of I/Os: 37; Number of Pins: 48; Number of I2C Channels: 2; Height: 1.6mm; Number of ADC Channels: 10
U3 = CMP-0244-00074-1: 500mA, Medium Current 1.2 to 37 V Adjustable Voltage Regulator, 3-Pin DPAK, Tape and Reel; DatasheetVersion: 1/02/2008; ComponentLink1Description: Manufacturer URL; PackageReference: TO-252; ComponentLink2Description: Datasheet; PackageDescription: 3-Pin Transistor Outline Package 2.28 mm Pitch, 9.7 mm Lead Span (DPAK); ComponentLink2URL: http://www.st.com/internet/com/TECHNICAL_RESOURCES/TECHNICAL_LITERATURE/DATASHEET/CD00000549.pdf; PackageVersion: 2011; ComponentLink1URL: http://www.st.com
U4 U5 = CMP-0253-00398-1: Cold Junction Compensated Thermocouple to Digital Converter, 14 Bits Temperature Resolution, -40 to 125 degC, 8-Pin SOIC (S8+4), Pb-Free, Tape ang Reel; Interface: SPI; Parasite Pwr.: No; Functions: Thermocouple-to-Digital Converter; ComponentLink3Description: Package Specification; DatasheetVersion: Rev. 2; Generic Part Number: MAX31855; PartNumber: MAX31855KASA+T; PackageReference: S8+4; ComponentLink3URL: http://pdfserv.maximintegrated.com/package_dwgs/21-0041.PDF; Code_JEDEC: MS-012; Packing: Tape ang Reel; PackageDescription: 8-Pin Small-Outline IC, Narrow, Body 3.9 x 4.9 mm, Pitch 1.27 mm; Mounting Technology: Surface Mount; ComponentLink1URL: http://www.maximintegrated.com/; PackageVersion: Rev. D, 10/2012; ComponentLink2URL: http://datasheets.maximintegrated.com/en/ds/MAX31855.pdf; ComponentLink1Description: Manufacturer URL; ComponentLink2Description: Datasheet
Y1 = CMP-1749-00003-1: Resistance Weld Thru-Hole Crystal, 16 MHz, -20 to 70 degC, 2-Pin THD, RoHS, Bulk; Voltage Rating: 250 V; Tolerance: 1%; Resistance: 221 kohm; Case\Package: Axial; Power Rating: 250 mW; RoHSCompliant: true; Package Quantity: 200; Packaging: Bulk; Min Operating Temperature: -55 degC; DatasheetVersion: Mar-15; ComponentLink1URL: http://www.foxonline.com/; Max Operating Temperature: 155 degC; PackageReference: FOXSLF160-20; Mount: Through Hole; PackageDescription: 2-Pin Through Hole Device, Body 11.35 x 4.65 mm; ComponentLink1Description: Manufacturer URL; ComponentLink2URL: http://www.foxonline.com/pdfs/hc49slf.pdf; ComponentLink2Description: Datasheet; Length: 0.248 inch